# EAGLE design main_board (EAGLE 9.6.0)
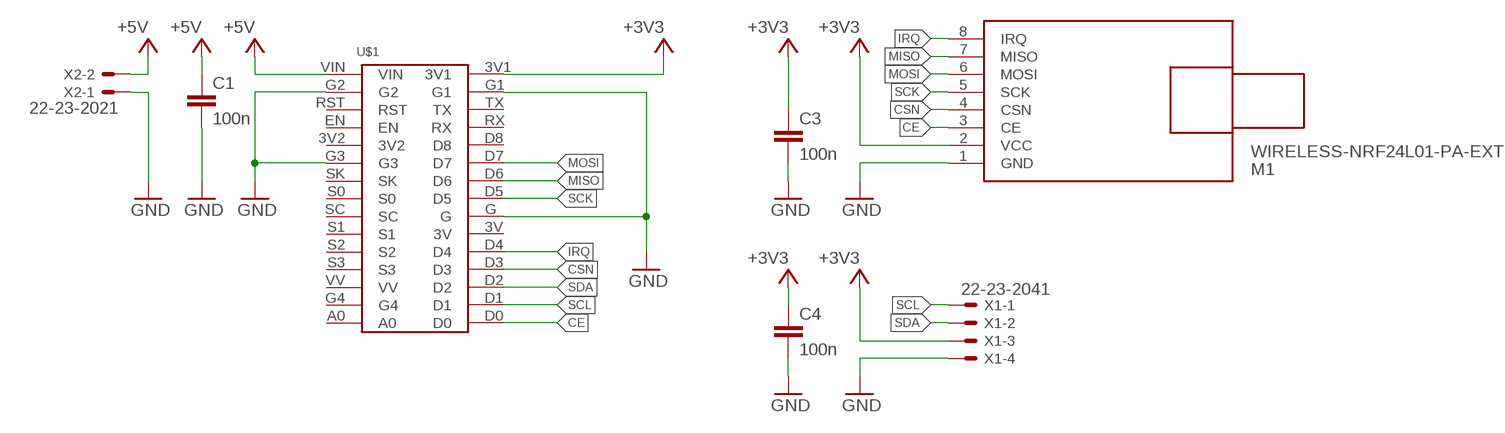
[diagram p0: schematic, sheet 1]

## Parts
C1  100n  C-EUC0805  [C0805]
C3  100n  C-EUC0805  [C0805]
C4  100n  C-EUC0805  [C0805]
M1  WIRELESS-NRF24L01-PA-EXT  [WIRELESS-NRF24L01-PA-EXT]
U$1  LOLIN  [LOLIN]
X1  22-23-2041  [22-23-2041]
X2  22-23-2021  [22-23-2021]

## Nets
+3V3: C3.1 C4.1 M1.2(VCC) U$1.3V1 X1.3
+5V: C1.1 U$1.VIN X2.2
CE: M1.3(CE) U$1.D0
CSN: M1.4(CSN) U$1.D3
GND: C1.2 C3.2 C4.2 M1.1(GND) U$1.G U$1.G1 U$1.G2 U$1.G3 X1.4 X2.1
IRQ: M1.8(IRQ) U$1.D4
MISO: M1.7(MISO) U$1.D6
MOSI: M1.6(MOSI) U$1.D7
SCK: M1.5(SCK) U$1.D5
SCL: U$1.D1 X1.1
SDA: U$1.D2 X1.2
Unconnected: U$1.3V U$1.3V2 U$1.A0 U$1.D8 U$1.EN U$1.G4 U$1.RST U$1.RX U$1.S0 U$1.S1 U$1.S2 U$1.S3 U$1.SC U$1.SK U$1.TX U$1.VV

## Library data of the parts
C1 C3 C4 = rcl:C-EU: CAPACITOR, European symbol; SPICEPREFIX: C
M1 = diy-modules:WIRELESS-NRF24L01-PA-EXT: 2.4 GHz Wireless Module based on NRF24L01 chip with preamplifier and external antenna Click here to find device on ebay.com <http://www.ebay.com/sch/nrf24l01+pa+lna+sma>
U$1 = Lolin:LOLIN
X1 = con-molex:22-23-2041: .100" (2.54mm) Center Header - 4 Pin; MF: MOLEX; MPN: 22-23-2041; OC_FARNELL: 1462920; OC_NEWARK: 38C0355
X2 = con-molex:22-23-2021: .100" (2.54mm) Center Header - 2 Pin; MF: MOLEX; MPN: 22-23-2021; OC_FARNELL: 1462926; OC_NEWARK: 25C3832

## Board
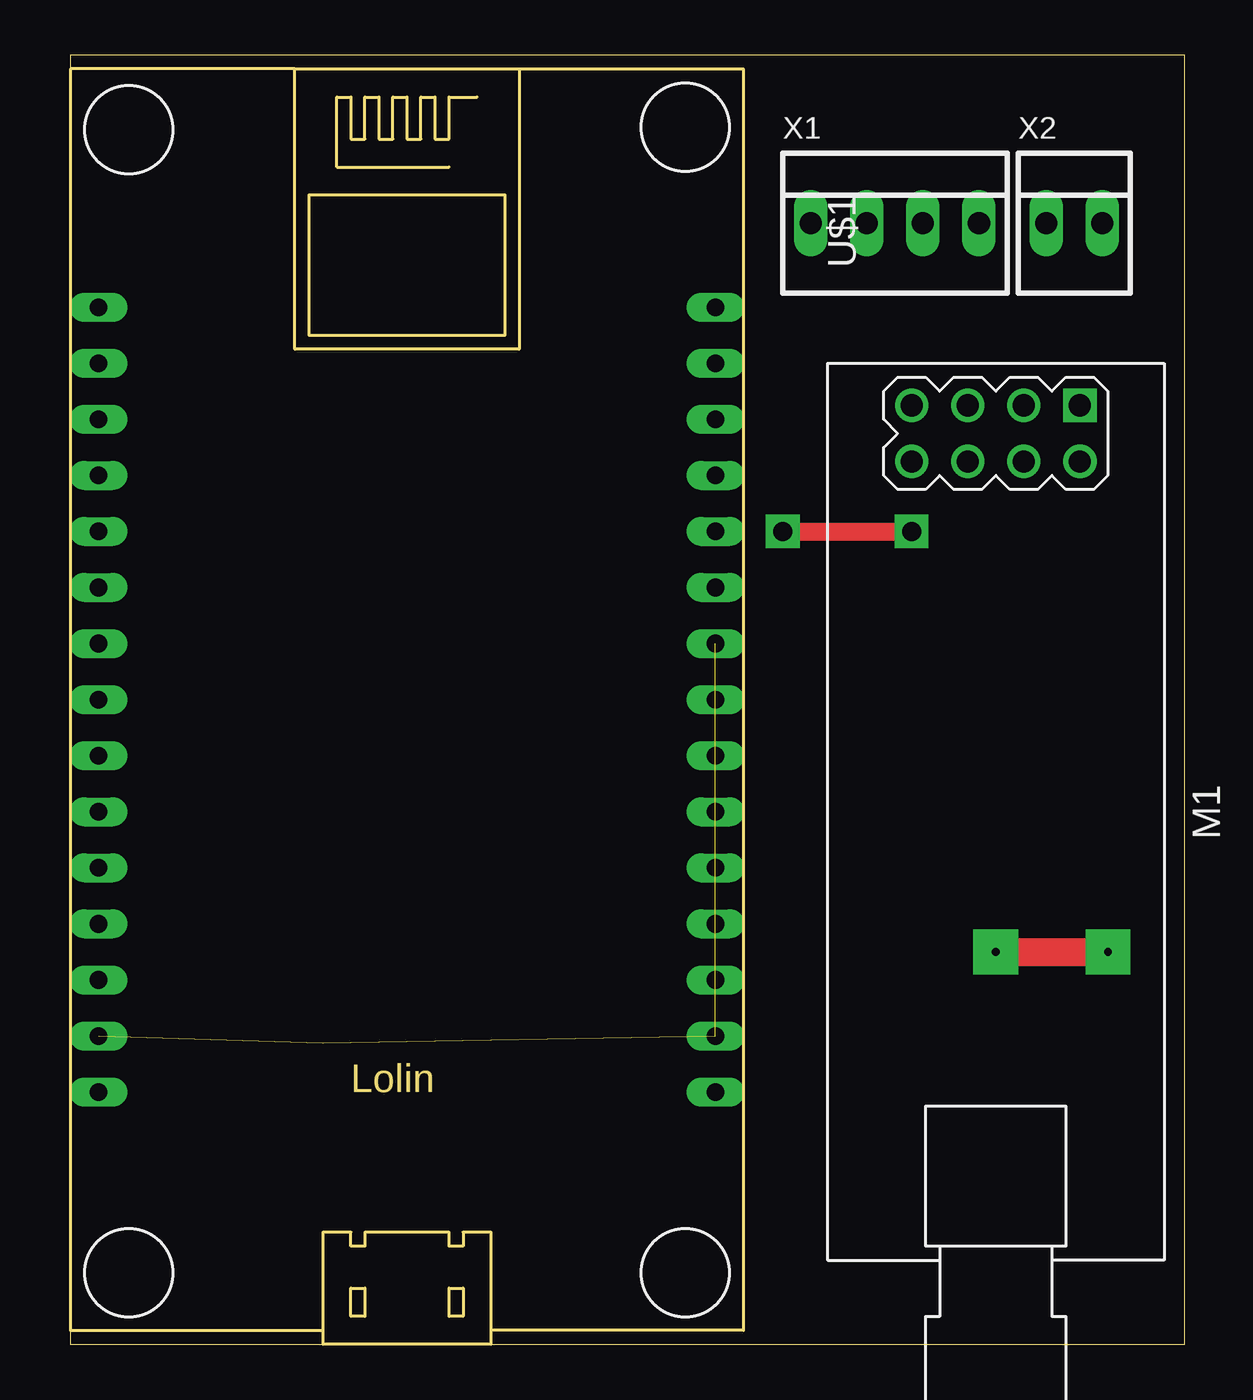
[diagram p1: board, top side]
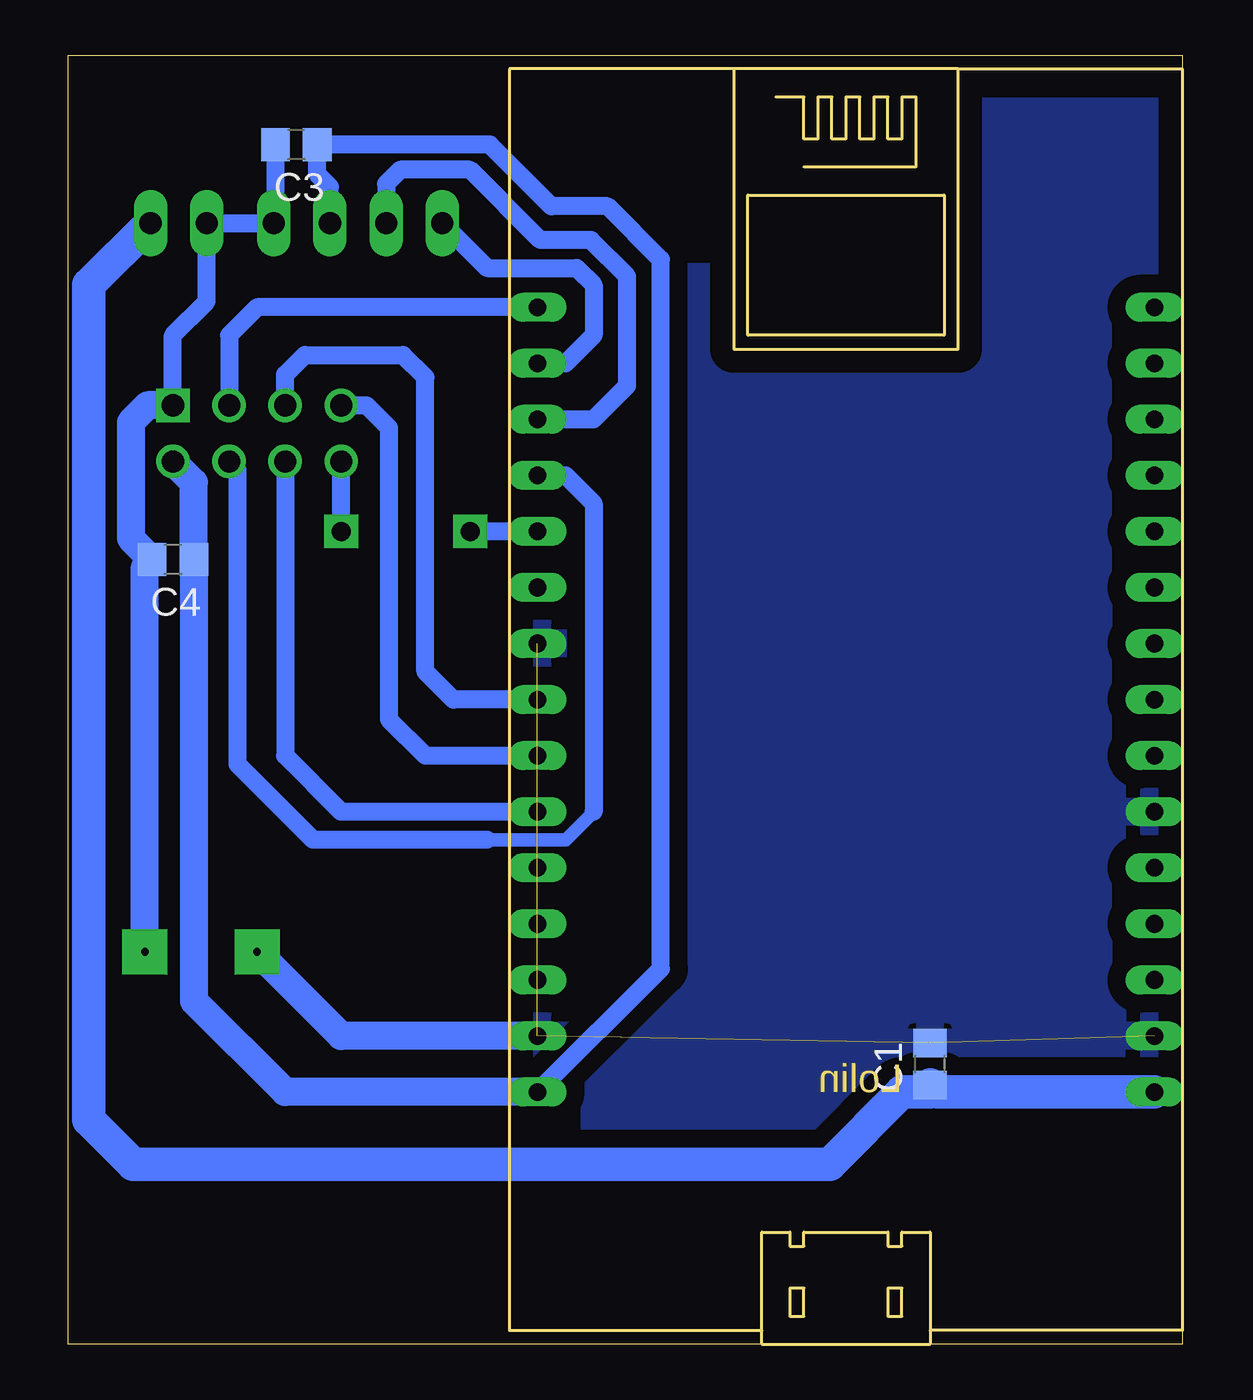
[diagram p2: board, bottom side, seen from below]

Size 50.47 x 58.41 mm. Coordinates in mm from the lower left corner, seen from the top.
Outline: 0,0 50.47,0 50.47,58.41 0,58.41 0,0
Copper layers (1*16): Top 0.035mm / dielectric 1.5mm / Bottom 0.035mm
Design rules "default": minimum track width 6mil, minimum drill 0.35mm, track to track 6mil, track to pad 6mil, pad to pad 6mil, via to via 6mil, smd to smd 6mil, copper to edge 40mil, drill to drill 6mil, minimum pad ring 10mil, minimum via ring 8mil, stop-mask expansion 4mil, vias tented up to drill 0mil, thermal gap 10mil

### Footprints (pad centres in the part's own frame; a part is rotated, then mirrored left to right if it is on the bottom)
C0805 = smd 1.3 x 1.5: 1 -0.95,0; 2 0.95,0
WIRELESS-NRF24L01-PA-EXT = drill 1 square: 1 -18.415,3.81 | drill 1: 2 -15.875,3.81; 3 -18.415,1.27; 4 -15.875,1.27; 5 -18.415,-1.27; 6 -15.875,-1.27; 7 -18.415,-3.81; 8 -15.875,-3.81
LOLIN = drill 0.8 long: 3V -6.35,13.97; 3V1 16.51,13.97; 3V2 6.35,-13.97; A0 -19.05,-13.97; D0 -19.05,13.97; D1 -16.51,13.97; D2 -13.97,13.97; D3 -11.43,13.97; D4 -8.89,13.97; D5 -1.27,13.97; D6 1.27,13.97; D7 3.81,13.97; D8 6.35,13.97; EN 8.89,-13.97; G -3.81,13.97; G1 13.97,13.97; G2 13.97,-13.97; G3 3.81,-13.97; G4 -16.51,-13.97; RST 11.43,-13.97; RX 8.89,13.97; S0 -1.27,-13.97; S1 -6.35,-13.97; S2 -8.89,-13.97; S3 -11.43,-13.97; SC -3.81,-13.97; SK 1.27,-13.97; TX 11.43,13.97; VIN 16.51,-13.97; VV -13.97,-13.97
22-23-2041 = drill 1 long: 1 -3.81,0; 2 -1.27,0; 3 1.27,0; 4 3.81,0
22-23-2021 = drill 1 long: 1 -1.27,0; 2 1.27,0

### Placement (x,y rotation side)
C1  11.43,12.7 90 bottom
C3  40.13,54.36 180 bottom
C4  45.72,35.56 180 bottom
M1  41.91,24.13 270 top
U$1  15.24,27.94 270 top
X1  37.34,50.8 0 top
X2  45.47,50.8 0 top

### Tracks (layer width: path | path; a pad name or v marks a point on that pad's centre or on a via)
+3V3
  Bottom 0.508: 45.59,40 M1.2
  Bottom 0.813: 38.61,50.29 X1.3 38.61,52.45 39.18,53.02 C3.1 31.37,54.36 28.58,51.56 26.03,51.56 23.62,49.15 23.62,17.02 U$1.3V1
  Bottom 1.27: M1.2 44.77,39.05 C4.1 44.77,15.56 40.64,11.43 U$1.3V1
+5V
  Bottom 1.27: C1.1 11.43,11.43
  Bottom 1.524: X2.2 49.53,48.01 49.53,10.16 47.52,8.15 15.98,8.15 12.7,11.43 11.43,11.43 | C1.1 11.11,11.43 U$1.VIN
CE
  Bottom 0.813: U$1.D0 41.91,46.99 43.18,45.72 M1.3
CSN
  Bottom 0.61: 26.67,24.13 27.94,22.86 31.5,22.86
  Bottom 0.813: 26.67,24.13 26.67,38.1 27.94,39.37 U$1.D3 | 31.5,22.86 39.37,22.86 42.8,26.29 42.8,39.62 M1.4
GND  (via drill 0.35 pad 2.03)  (3 unrouted)
  Top 1.27: v41.91,17.78 v46.99,17.78
  Bottom 0.813: C3.2 41.08,50.87 X1.4 X2.1 44.2,47.24 45.72,45.72 M1.1
  Bottom 1.27: M1.1 46.86,42.55 47.62,41.78 47.62,36.52 C4.2 46.99,35.24 v46.99,17.78 | v41.91,17.78 38.1,13.97 U$1.G1
  pour Bottom (isolate 0.813): -5.08,55.88 -5.08,2.54 29.21,2.54 29.21,55.88
IRQ  (via drill 0.85 pad 1.52)
  Top 0.813: v32.26,36.83 v38.1,36.83
  Bottom 0.813: v38.1,36.83 M1.8 | U$1.D4 v32.26,36.83
MISO
  Bottom 0.813: M1.7 36.96,42.55 35.94,41.53 35.94,28.32 34.29,26.67 U$1.D6
MOSI
  Bottom 0.813: M1.6 40.64,26.67 38.1,24.13 U$1.D7
SCK
  Bottom 0.813: 40.64,42.93 M1.5 40.64,43.94 39.75,44.83 35.31,44.83 34.29,43.81 34.29,30.48 33.02,29.21 U$1.D5
SCL
  Bottom 0.813: U$1.D1 27.94,44.45 26.67,45.72 26.67,48.01 27.43,48.77 31.5,48.77 X1.1
SDA
  Bottom 0.813: U$1.D2 26.67,41.91 25.15,43.43 25.15,48.39 26.8,50.04 29.08,50.04 32.26,53.21 35.43,53.21 36.07,52.58 X1.2